# Altium schematic sheet tempature.SchDoc: NTC
size A4; Date: 10.18.2025; CheckedBy: BCY; DrawnBy: miaow; DocumentNumber: 12; Revision: v0.0.1; SheetNumber: 12; SheetTotal: 12; Sample: A0; Url: github.com/miaow-cn/pcb-lib; Liscense: GPLv3; Board: MIAOW FOC BOARD; BoardType: MAIN_PCB; Desc: ntc tempature sensors
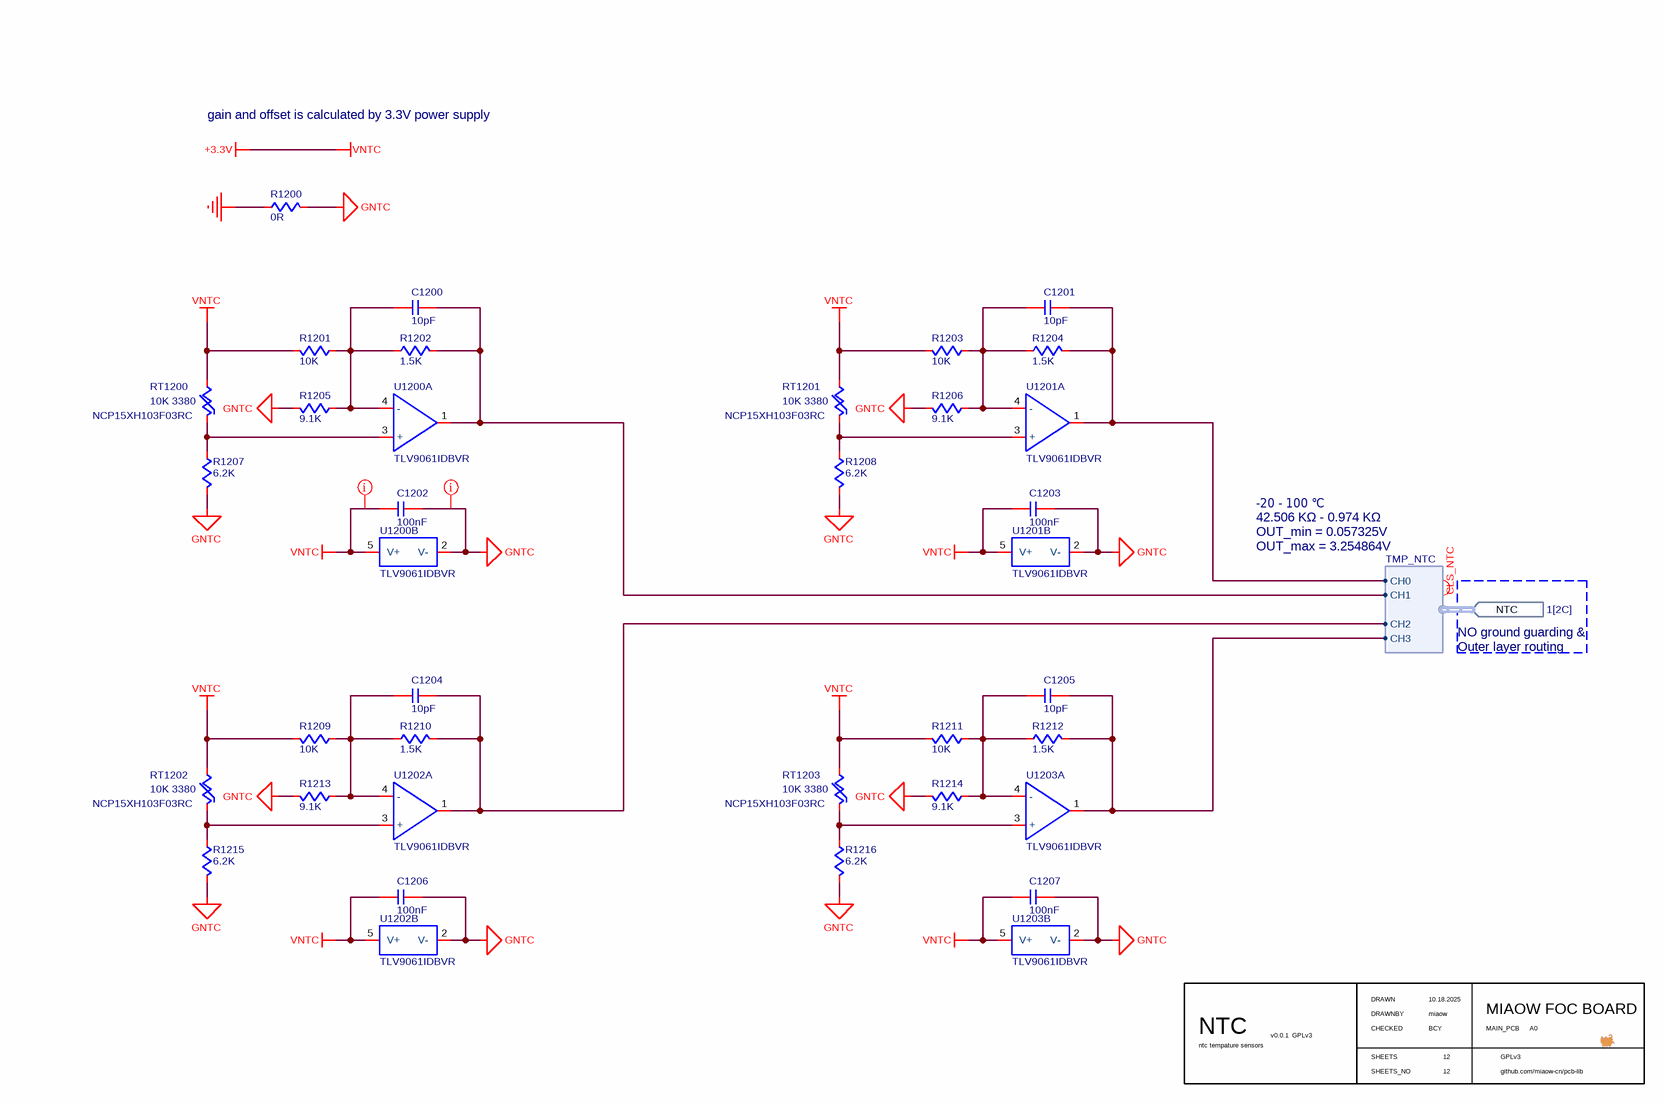
[diagram p0: tempature.SchDoc]

## Parts
C1200  value 10pF  [C0402]  (hidden comment: C-NOMO)
C1201  value 10pF  [C0402]  (hidden comment: C-NOMO)
C1202  value 100nF  [C0402]  (hidden comment: C-NOMO)
C1203  value 100nF  [C0402]  (hidden comment: C-NOMO)
C1204  value 10pF  [C0402]  (hidden comment: C-NOMO)
C1205  value 10pF  [C0402]  (hidden comment: C-NOMO)
C1206  value 100nF  [C0402]  (hidden comment: C-NOMO)
C1207  value 100nF  [C0402]  (hidden comment: C-NOMO)
R1200  value 0R  [R0402]  (hidden comment: R)
R1201  value 10K  [R0402]  (hidden comment: R)
R1202  value 1.5K  [R0402]  (hidden comment: R)
R1203  value 10K  [R0402]  (hidden comment: R)
R1204  value 1.5K  [R0402]  (hidden comment: R)
R1205  value 9.1K  [R0402]  (hidden comment: R)
R1206  value 9.1K  [R0402]  (hidden comment: R)
R1207  value 6.2K  [R0402]  (hidden comment: R)
R1208  value 6.2K  [R0402]  (hidden comment: R)
R1209  value 10K  [R0402]  (hidden comment: R)
R1210  value 1.5K  [R0402]  (hidden comment: R)
R1211  value 10K  [R0402]  (hidden comment: R)
R1212  value 1.5K  [R0402]  (hidden comment: R)
R1213  value 9.1K  [R0402]  (hidden comment: R)
R1214  value 9.1K  [R0402]  (hidden comment: R)
R1215  value 6.2K  [R0402]  (hidden comment: R)
R1216  value 6.2K  [R0402]  (hidden comment: R)
RT1200  NCP15XH103F03RC  value 10K 3380  [NTC0402]
RT1201  NCP15XH103F03RC  value 10K 3380  [NTC0402]
RT1202  NCP15XH103F03RC  value 10K 3380  [NTC0402]
RT1203  NCP15XH103F03RC  value 10K 3380  [NTC0402]
U1200  TLV9061IDBVR  [TLV9061IDBVR]  (parts A,B of 2)
U1201  TLV9061IDBVR  [TLV9061IDBVR]  (parts A,B of 2)
U1202  TLV9061IDBVR  [TLV9061IDBVR]  (parts A,B of 2)
U1203  TLV9061IDBVR  [TLV9061IDBVR]  (parts A,B of 2)

## Ports
NTC (in, harness TMP_NTC, see 1[2C])

## Harnesses
TMP_NTC: CH0, CH1, CH2, CH3

## Nets
+3.3V: C1202.2 C1203.2 C1206.2 C1207.2 R1201.1 R1203.1 R1209.1 R1211.1 RT1200.2 RT1201.2 RT1202.2 RT1203.2 U1200.5(V+) U1201.5(V+) U1202.5(V+) U1203.5(V+)  [also labelled VNTC]
GND: R1200.2
GNTC: C1202.1 C1203.1 C1206.1 C1207.1 R1200.1 R1205.1 R1206.1 R1207.1 R1208.1 R1213.1 R1214.1 R1215.1 R1216.1 U1200.2(V-) U1201.2(V-) U1202.2(V-) U1203.2(V-)
NetC1200_1: C1200.1 R1202.1 U1200.1(OUT) ; port NTC.CH1
NetC1200_2: C1200.2 R1201.2 R1202.2 R1205.2 U1200.4(-)
NetC1201_1: C1201.1 R1204.1 U1201.1(OUT) ; port NTC.CH0
NetC1201_2: C1201.2 R1203.2 R1204.2 R1206.2 U1201.4(-)
NetC1204_1: C1204.1 R1210.1 U1202.1(OUT) ; port NTC.CH2
NetC1204_2: C1204.2 R1209.2 R1210.2 R1213.2 U1202.4(-)
NetC1205_1: C1205.1 R1212.1 U1203.1(OUT) ; port NTC.CH3
NetC1205_2: C1205.2 R1211.2 R1212.2 R1214.2 U1203.4(-)
NetR1207_2: R1207.2 RT1200.1 U1200.3(+)
NetR1208_2: R1208.2 RT1201.1 U1201.3(+)
NetR1215_2: R1215.2 RT1202.1 U1202.3(+)
NetR1216_2: R1216.2 RT1203.1 U1203.3(+)

## Layout directives
net class CLS_PWR: +3.3V, GNTC
net class CLS_NTC: (no net found under the mark)

## Notes on the sheet
- gain and offset is calculated by 3.3V power supply
- -20 - 100 ℃
  42.506 KΩ - 0.974 KΩ
  OUT_min = 0.057325V
  OUT_max = 3.254864V
- NO ground guarding &
  Outer layer routing
- DRAWN
- CHECKED
- DRAWNBY
- SHEETS
- SHEETS_NO

## Library data of the parts
C1200-C1207 = C-NOMO: voltage: 25V; precision: 5%
R1200-R1216 = R: precision: 1%
RT1200-RT1203 = NCP15XH103F03RC: NTC - 10K, 3380, 1%; precision: 1%; Supplier Part Number 1: C13564; Supplier 1: LCSC
U1200-U1203 = TLV9061IDBVR: OPA - 1ch, 1.8V - 5.5V, r2r, 0.3mV, 10MHz, 10nVHz^0.5, 0.5pA; Supplier 1: LCSC; Supplier Part Number 1: C398358